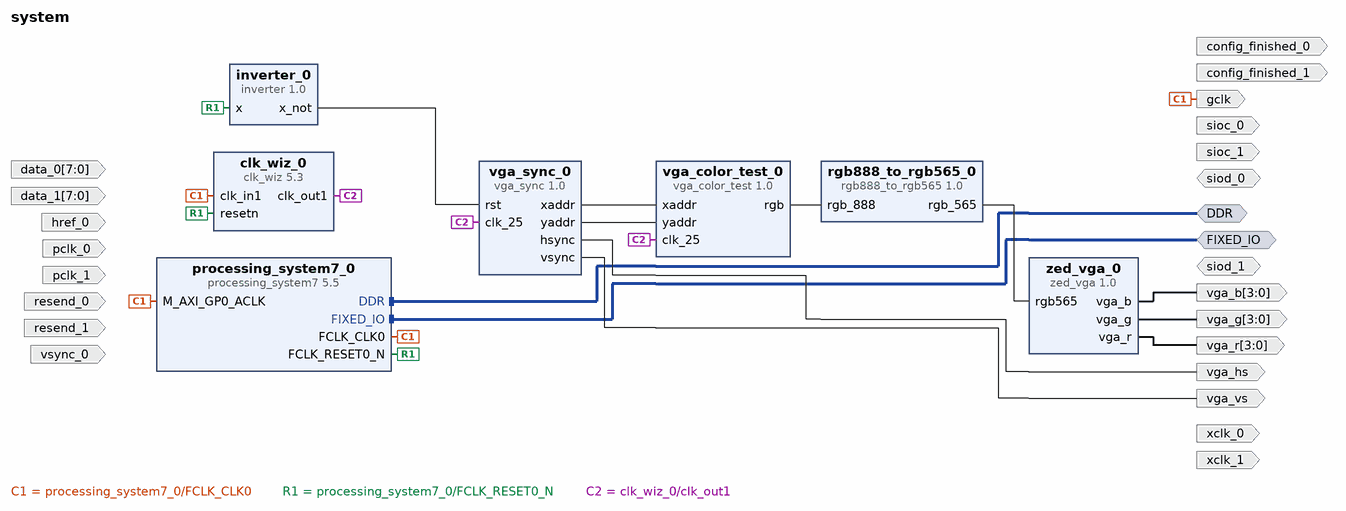
[diagram p0: block diagram of the top level]
# Vivado block design system, xc7z020clg484-1, Vivado 2016.4
create_bd_design system

create_bd_intf_port -mode Master -vlnv xilinx.com:interface:ddrx_rtl:1.0 DDR
create_bd_intf_port -mode Master -vlnv xilinx.com:display_processing_system7:fixedio_rtl:1.0 FIXED_IO
create_bd_port -dir I pclk_0
create_bd_port -dir I pclk_1
create_bd_port -dir O config_finished_0
create_bd_port -dir O sioc_0
create_bd_port -dir IO siod_0
create_bd_port -dir O xclk_0
create_bd_port -dir O xclk_1
create_bd_port -dir O config_finished_1
create_bd_port -dir O sioc_1
create_bd_port -dir IO siod_1
create_bd_port -dir I resend_0
create_bd_port -dir I resend_1
create_bd_port -dir I -from 7 -to 0 data_1
create_bd_port -dir I -from 7 -to 0 data_0
create_bd_port -dir O gclk
create_bd_port -dir O vga_hs
create_bd_port -dir O vga_vs
create_bd_port -dir O -from 3 -to 0 vga_r
create_bd_port -dir O -from 3 -to 0 vga_g
create_bd_port -dir O -from 3 -to 0 vga_b
create_bd_port -dir I href_0
create_bd_port -dir I vsync_0

create_bd_cell -type ip -vlnv xilinx.com:ip:processing_system7:5.5 processing_system7_0
set_property -dict {CONFIG.PCW_FPGA0_PERIPHERAL_FREQMHZ 100 CONFIG.preset ZedBoard} [get_bd_cells processing_system7_0]
create_bd_cell -type ip -vlnv xilinx.com:ip:clk_wiz:5.3 clk_wiz_0
set_property -dict [list \
  CONFIG.CLKOUT1_REQUESTED_OUT_FREQ 25 \
  CONFIG.RESET_PORT resetn \
  CONFIG.MMCM_DIVCLK_DIVIDE 1 \
  CONFIG.MMCM_CLKFBOUT_MULT_F 9.125 \
  CONFIG.MMCM_CLKOUT0_DIVIDE_F 36.500 \
  CONFIG.RESET_TYPE ACTIVE_LOW \
  CONFIG.CLKOUT1_JITTER 181.828 \
  CONFIG.CLKOUT1_PHASE_ERROR 104.359 \
] [get_bd_cells clk_wiz_0]
create_bd_cell -type ip -vlnv xilinx.com:user:zed_vga:1.0 zed_vga_0
create_bd_cell -type ip -vlnv xilinx.com:user:vga_sync:1.0 vga_sync_0
create_bd_cell -type ip -vlnv xilinx.com:user:vga_color_test:1.0 vga_color_test_0
create_bd_cell -type ip -vlnv user.org:user:inverter:1.0 inverter_0
create_bd_cell -type ip -vlnv xilinx.com:user:rgb888_to_rgb565:1.0 rgb888_to_rgb565_0

# ---- connections ----

connect_bd_intf_net [get_bd_intf_ports DDR] [get_bd_intf_pins processing_system7_0/DDR]
connect_bd_intf_net [get_bd_intf_ports FIXED_IO] [get_bd_intf_pins processing_system7_0/FIXED_IO]
connect_bd_net [get_bd_pins processing_system7_0/FCLK_CLK0] \
  [get_bd_pins processing_system7_0/M_AXI_GP0_ACLK] [get_bd_ports gclk] [get_bd_pins clk_wiz_0/clk_in1]
connect_bd_net [get_bd_pins processing_system7_0/FCLK_RESET0_N] [get_bd_pins clk_wiz_0/resetn] [get_bd_pins inverter_0/x]
connect_bd_net [get_bd_pins clk_wiz_0/clk_out1] [get_bd_pins vga_sync_0/clk_25] [get_bd_pins vga_color_test_0/clk_25]
connect_bd_net [get_bd_pins inverter_0/x_not] [get_bd_pins vga_sync_0/rst]
connect_bd_net [get_bd_pins vga_sync_0/xaddr] [get_bd_pins vga_color_test_0/xaddr]
connect_bd_net [get_bd_pins vga_sync_0/yaddr] [get_bd_pins vga_color_test_0/yaddr]
connect_bd_net [get_bd_pins vga_color_test_0/rgb] [get_bd_pins rgb888_to_rgb565_0/rgb_888]
connect_bd_net [get_bd_pins rgb888_to_rgb565_0/rgb_565] [get_bd_pins zed_vga_0/rgb565]
connect_bd_net [get_bd_pins zed_vga_0/vga_r] [get_bd_ports vga_r]
connect_bd_net [get_bd_pins zed_vga_0/vga_g] [get_bd_ports vga_g]
connect_bd_net [get_bd_pins zed_vga_0/vga_b] [get_bd_ports vga_b]
connect_bd_net [get_bd_pins vga_sync_0/hsync] [get_bd_ports vga_hs]
connect_bd_net [get_bd_pins vga_sync_0/vsync] [get_bd_ports vga_vs]

validate_bd_design
save_bd_design
